# EAGLE design Teensy_Polulu_8848 (EAGLE 9.4.2)
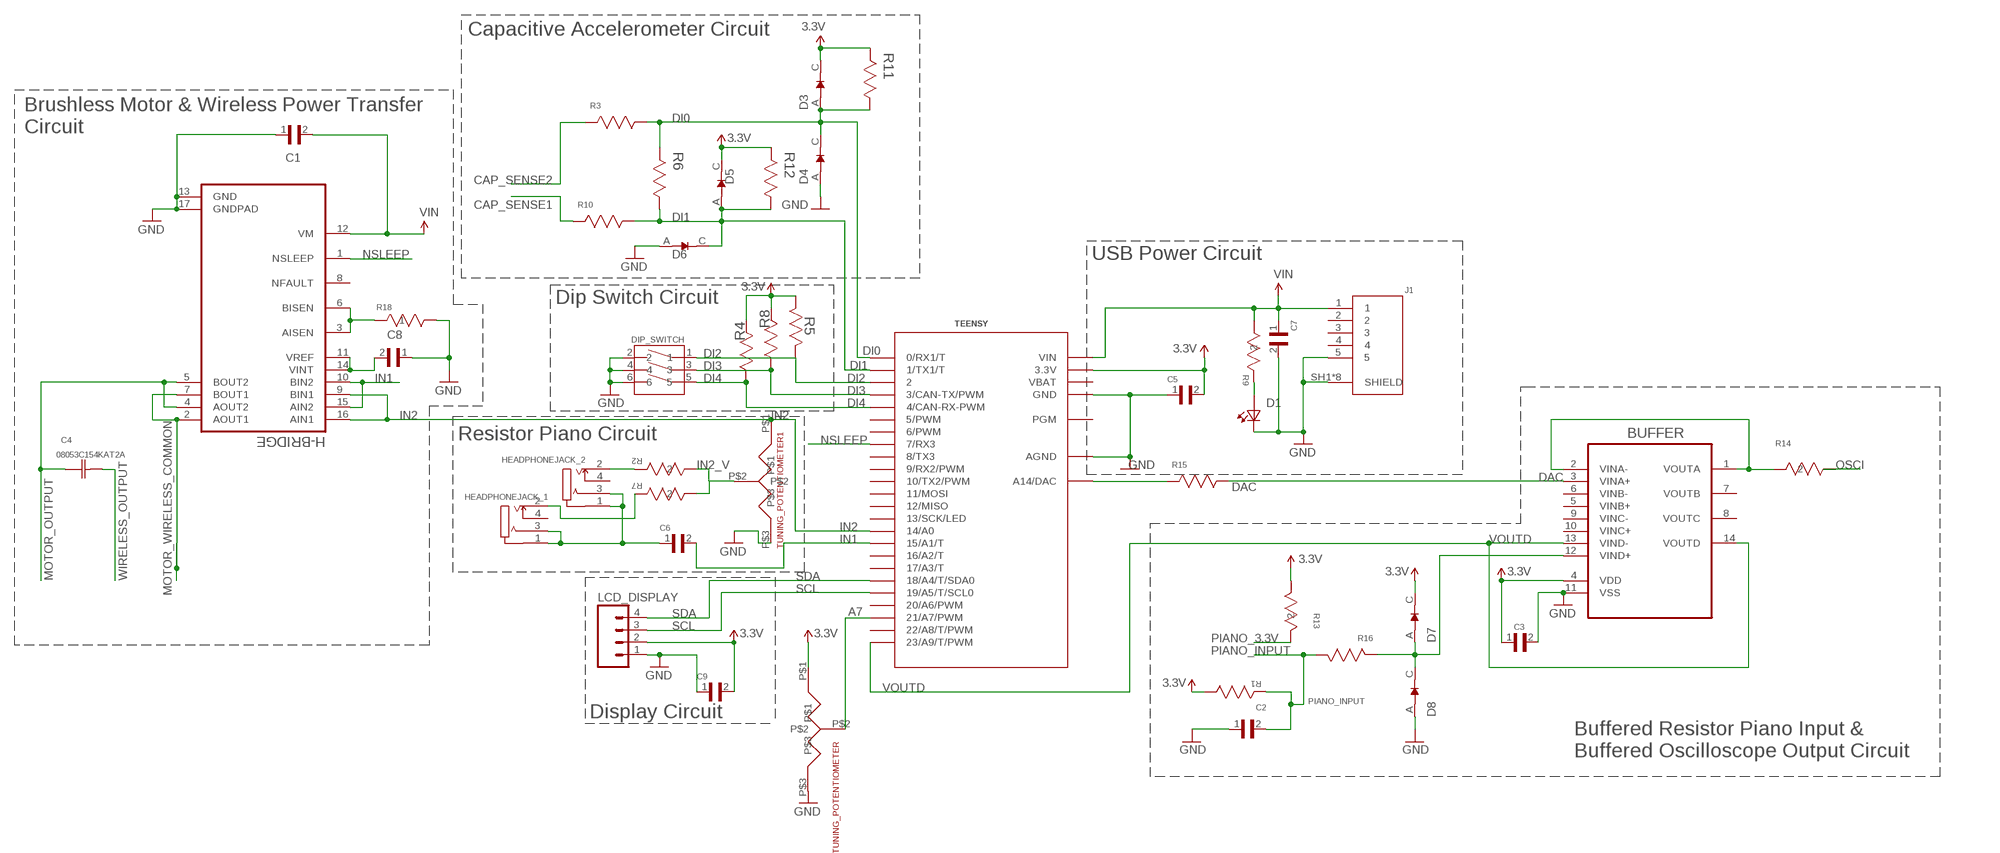
[diagram p0: schematic, sheet 1]

## Parts
BUFFER  MCP6024-I/SL  [SOIC127P600X175-14N]
C1  GRM219R60J476ME44D  [CAPC2012X135N]
C2  C2012C0G1V303J060AC  [INDC2012X87N]
C3  GRM219R60J476ME44D  [CAPC2012X135N]
C4  08053C154KAT2A  [CAPC2013X94N]
C5  GRM219R60J476ME44D  [CAPC2012X135N]
C6  GRM219R60J476ME44D  [CAPC2012X135N]
C7  GRM219R60J476ME44D  [CAPC2012X135N]
C8  GRM21BR60J225KA01L  [CAPC2012X135N]
C9  GRM219R60J476ME44D  [CAPC2012X135N]
D1  TLMY1100-GS08  [0603]
D3  1N4148W-7-F  [SOD3715X135N]
D4  1N4148W-7-F  [SOD3715X135N]
D5  1N4148W-7-F  [SOD3715X135N]
D6  1N4148W-7-F  [SOD3715X135N]
D7  1N4148W-7-F  [SOD3715X135N]
D8  1N4148W-7-F  [SOD3715X135N]
DIP_SWITCH  SDA03H1SBD  [SW_SDA03H1SBD]
H-BRIDGE  DRV8848PWP  [SOP65P640X120-17N]
HEADPHONEJACK_1  47257-0001  [MOLEX_47257-0001]
HEADPHONEJACK_2  47257-0001  [MOLEX_47257-0001]
J1  1050170001  [MOLEX_1050170001]
LCD_DISPLAY  M04POLAR  [MOLEX-1X4]
R1  RT0805FRE071ML  [RESC2013X65N]
R2  RT0805FRE07100RL  [RC0805N]
R3  RT0805FRE0710KL  [RESC2013X65N]
R4  RT0805FRE0710KL  [RESC2013X65N]
R5  RT0805FRE0710KL  [RESC2013X65N]
R6  RT0805FRE071ML  [RESC2013X65N]
R7  RT0805FRE07100RL  [RC0805N]
R8  RT0805FRE0710KL  [RESC2013X65N]
R9  RT0805FRE071KL  [RC0805N]
R10  RT0805FRE0710KL  [RESC2013X65N]
R11  RT0805FRE071ML  [RESC2013X65N]
R12  RT0805FRE071ML  [RESC2013X65N]
R13  RT0805BRD0749R9L  [RC0805N]
R14  RT0805FRE071KL  [RC0805N]
R15  RT0805FRE0710KL  [RESC2013X65N]
R16  RT0805FRE0710KL  [RESC2013X65N]
R18  CSRN2512FKR250  [STA_CSRN2512]
TEENSY  TEENSY_3.1-3.2_OUTER_ROW  [TEENSY_3.0-3.2&LC_OUTER_ROW]
TUNING_POTENTIOMETER  POT_PTV09A-4225F-B102-ND  [POT_PTV09A-4225F-B102-ND]
TUNING_POTENTIOMETER1  POT_PTV09A-4225F-B102-ND  [POT_PTV09A-4225F-B102-ND]

## Nets
3.3V: BUFFER.4(VDD) C3.1 C5.2 C9.2 D3.C(K) D5.C(K) D7.C(K) LCD_DISPLAY.2 R1.1(R1) R4.1(R1) R5.1(R1) R8.1(R1) R11.2(R2) R12.2(R2) R13.1 TEENSY.3.3V TEENSY.3.3V1(3.3V) TUNING_POTENTIOMETER.P$1
A7: TEENSY.21/A7(21/A7/PWM) TUNING_POTENTIOMETER.P$2
CAP_SENSE1: R10.2(R2)
CAP_SENSE2: R3.2(R2)
DAC: BUFFER.3(VINA+) R15.1(R1)
DI0: D3.A D4.C(K) R3.1(R1) R6.2(R2) R11.1(R1) TEENSY.0(0/RX1/T)
DI1: D5.A D6.C(K) R6.1(R1) R10.1(R1) R12.1(R1) TEENSY.1(1/TX1/T)
DI2: DIP_SWITCH.1 R5.2(R2) TEENSY.2
DI3: DIP_SWITCH.3 R8.2(R2) TEENSY.3(3/CAN-TX/PWM)
DI4: DIP_SWITCH.5 R4.2(R2) TEENSY.4(4/CAN-RX-PWM)
GND: BUFFER.11(VSS) C1.1 C2.1 C3.2 C5.1 C7.2 C8.1 C9.1 D1.1(K2) D4.A D6.A D8.A DIP_SWITCH.2 DIP_SWITCH.4 DIP_SWITCH.6 H-BRIDGE.13(GND) H-BRIDGE.17(GNDPAD) J1.5 J1.SH1(SHIELD) J1.SH2(SHIELD) J1.SH3(SHIELD) J1.SH4(SHIELD) J1.SH5(SHIELD) J1.SH6(SHIELD) J1.SH7(SHIELD) J1.SH8(SHIELD) LCD_DISPLAY.1 R18.2 TEENSY.AGND TEENSY.GND TEENSY.GND1(GND) TUNING_POTENTIOMETER1.P$3 TUNING_POTENTIOMETER.P$3
IN1: C6.2 H-BRIDGE.10(BIN2) H-BRIDGE.15(AIN2) TEENSY.15/A1(15/A1/T)
IN2: H-BRIDGE.9(BIN1) H-BRIDGE.16(AIN1) TEENSY.14/A0 TUNING_POTENTIOMETER1.P$1
IN2_V: R2.2 R7.2 TUNING_POTENTIOMETER1.P$2
MOTOR_OUTPUT: C4.1(C1) H-BRIDGE.4(AOUT2) H-BRIDGE.5(BOUT2)
MOTOR_WIRELESS_COMMON: H-BRIDGE.2(AOUT1) H-BRIDGE.7(BOUT1)
N$1: HEADPHONEJACK_2.2 R2.1
N$2: D1.2(A2) R9.1
N$3: HEADPHONEJACK_1.2 R7.1
N$10: H-BRIDGE.3(AISEN) H-BRIDGE.6(BISEN) R18.1
N$14: C8.2 H-BRIDGE.11(VREF) H-BRIDGE.14(VINT)
N$24: C6.1 HEADPHONEJACK_1.1 HEADPHONEJACK_1.3 HEADPHONEJACK_2.1 HEADPHONEJACK_2.3
N$27: BUFFER.1(VOUTA) BUFFER.2(VINA-) R14.2
N$28: BUFFER.12(VIND+) D7.A D8.C(K) R16.2(R2)
N$31: R15.2(R2) TEENSY.RESET/DAC(A14/DAC)
NSLEEP: H-BRIDGE.1(NSLEEP) TEENSY.7(7/RX3)
OSCI: R14.1
PIANO_3.3V: R13.2
PIANO_INPUT: C2.2 R1.2(R2) R16.1(R1)
SCL: LCD_DISPLAY.3 TEENSY.19/A5(19/A5/T/SCL0)
SDA: LCD_DISPLAY.4 TEENSY.18/A4(18/A4/T/SDA0)
VIN: C1.2 C7.1 H-BRIDGE.12(VM) J1.1 R9.2 TEENSY.VIN
VOUTD: BUFFER.13(VIND-) BUFFER.14(VOUTD) TEENSY.23/A9(23/A9/T/PWM)
WIRELESS_OUTPUT: C4.2(C2)
Unconnected: BUFFER.5(VINB+) BUFFER.6(VINB-) BUFFER.7(VOUTB) BUFFER.8(VOUTC) BUFFER.9(VINC-) BUFFER.10(VINC+) H-BRIDGE.8(NFAULT) HEADPHONEJACK_1.4 HEADPHONEJACK_2.4 J1.2 J1.3 J1.4 TEENSY.5(5/PWM) TEENSY.6(6/PWM) TEENSY.8(8/TX3) TEENSY.9(9/RX2/PWM) TEENSY.10(10/TX2/PWM) TEENSY.11(11/MOSI) TEENSY.12(12/MISO) TEENSY.13(13/SCK/LED) TEENSY.16/A2(16/A2/T) TEENSY.17/A3(17/A3/T) TEENSY.20/A6(20/A6/PWM) TEENSY.22/A8(22/A8/T/PWM) TEENSY.PGM

## Notes on the sheet
- Capacitive Accelerometer Circuit
- Brushless Motor & Wireless Power Transfer 
  Circuit
- USB Power Circuit
- Dip Switch Circuit
- Resistor Piano Circuit
- Display Circuit
- Buffered Resistor Piano Input & 
  Buffered Oscilloscope Output Circuit

## Power pins joined to a net without a drawn wire
VBAT: TEENSY.VBAT

## Library data of the parts
BUFFER = MCP6024-I_SL:MCP6024-I/SL: IC OPAMP 2.5V QUAD R-R; DESCRIPTION: MCP6024 Series 5.5 V 10 MHz Rail-to-Rail I/O Operational Amplifier SOIC-14; DIGI-KEY_PART_NUMBER: MCP6024-I/SL-ND; DIGI-KEY_PURCHASE_URL: https://www.digikey.com/product-detail/en/microchip-technology/MCP6024-I-SL/MCP6024-I-SL-ND/417835?utm_source=snapeda&utm_medium=aggregator&utm_campaign=symbol; MF: Microchip; MP: MCP6024-I/SL; PACKAGE: SOIC-14 Microchip
C1 C3 C5-C7 C9 = GRM219R60J476ME44D:GRM219R60J476ME44D: CAP CER 47UF 6.3V X5R 0805; DESCRIPTION: Cap Cer 47uf 6.3v X5r 0805; DIGI-KEY_PART_NUMBER: 490-13249-1-ND; DIGI-KEY_PURCHASE_URL: https://www.digikey.com/product-detail/en/murata-electronics-north-america/GRM219R60J476ME44D/490-13249-1-ND/5877457?utm_source=snapeda&utm_medium=aggregator&utm_campaign=symbol; MF: Murata; MP: GRM219R60J476ME44D; PACKAGE: 0805 Murata
C2 = C2012C0G1V303J060AC:C2012C0G1V303J060AC: GENERAL PURPOSE / 7" (180MM); AVAILABILITY: Unavailable; DESCRIPTION: Cap Ceramic 0.03uF 35V C0G 5% Pad SMD 0805 125C T/R; MF: TDK; MP: C2012C0G1V303J060AC; PACKAGE: 0805 TDK; PRICE: None
C4 = 08053C154KAT2A:08053C154KAT2A: Capacitor 0805; AVAILABILITY: Unavailable; DESCRIPTION: 0805 150nF Ceramic Multilayer Capacitor, 25 VDC, +125degC, X7R Dielec, +/-10%; MF: AVX; MP: 08053C154KAT2A; PACKAGE: 0805 AVX; PRICE: None
C8 = GRM21BR60J225KA01L:GRM21BR60J225KA01L: SMT X5R ceramic capacitor 2.2uF 6.3V; DESCRIPTION: Multilayer Ceramic Capacitor, GRM Series, 2.2 - F, - 10%, X5R, 6.3 V, 0805 [2012 Metric]; DIGI-KEY_PART_NUMBER: 490-1712-1-ND; DIGI-KEY_PURCHASE_URL: https://www.digikey.com/product-detail/en/murata-electronics-north-america/GRM21BR60J225KA01L/490-1712-1-ND/587428?utm_source=snapeda&utm_medium=aggregator&utm_campaign=symbol; MF: Murata; MP: GRM21BR60J225KA01L; PACKAGE: 0805 Murata
D1 = TLMY1100-GS08:TLMY1100-GS08: http://octopart.com/tlmy1100-gs08-vishay+semiconductor-9355178; AVAILABILITY: Unavailable; DESCRIPTION: Yellow 0603 160° 80 mcd 2.1 V 30 mA Non Diffused Surface Mount LED; MF: Vishay Semiconductor; MP: TLMY1100-GS08; PACKAGE: 0603 Vishay; PRICE: None
D3-D8 = 1N4148W-7-F:1N4148W-7-F: 1N4148W Series 2 A 100 V 400 mW Surface Mount Fast Switching Diode - SOD-123; AVAILABILITY: Unavailable; DESCRIPTION: 1N4148W Series 2 A 100 V 400 mW Surface Mount Fast Switching Diode - SOD-123; MF: Diodes Inc.; MP: 1N4148W-7-F; PACKAGE: SOD-123 Diodes Inc.; PRICE: None
DIP_SWITCH = SDA03H1SBD:SDA03H1SBD: Switch DIP OFF ON SPST 3 Raised Slide 0.1A 24VDC Gull Wing 1000Cycles 2.54mm SMD Tube; AVAILABILITY: Unavailable; DESCRIPTION: Switch DIP OFF ON SPST 3 Raised Slide 0.1A 24VDC Gull Wing 1000Cycles 2.54mm SMD Tube; MF: C&K; MP: SDA03H1SBD; PACKAGE: None; PRICE: None
H-BRIDGE = DRV8848PWP:DRV8848PWP: None; AVAILABILITY: Unavailable; DESCRIPTION: 2A Dual H-Bridge Motor Driver _PWM Control_ 16-HTSSOP -40 to 85; MF: Texas Instruments; MP: DRV8848PWP; PACKAGE: HTSSOP-16 Texas Instruments; PRICE: None
HEADPHONEJACK_1 HEADPHONEJACK_2 = 47257-0001:47257-0001: Conn Phone Jack F 4 POS Solder RA Thru-Hole 4 Terminal 1 Port Tube; AVAILABILITY: Unavailable; DESCRIPTION: Conn Phone Jack F 4 POS Solder RA Thru-Hole 4 Terminal 1 Port Tube; MF: Molex; MP: 47257-0001; PACKAGE: None; PRICE: None
J1 = 1050170001:1050170001: Conn.; Data; USB; Recept.; Micro; B Type; Bottom Mount, SMT, with Solder Tabs, Lead-Free; DESCRIPTION: Conn.; Data; USB; Recept.; Micro; B Type; Bottom Mount, SMT, with Solder Tabs, Lead-Free; DIGI-KEY_PART_NUMBER: WM1399CT-ND; DIGI-KEY_PURCHASE_URL: https://www.digikey.com/product-detail/en/molex/1050170001/WM1399CT-ND/2350885?utm_source=snapeda&utm_medium=aggregator&utm_campaign=symbol; MF: Molex; MP: 1050170001; PACKAGE: None
LCD_DISPLAY = SparkFun-Connectors:M04: Header 4 Standard 4-pin 0.1" header. Use with straight break away headers (SKU : PRT-00116), right angle break away headers (PRT-00553), swiss pins (PRT-00743), machine pins (PRT-00117), and female headers (PRT-00115). Molex polarized connector foot print use with SKU : PRT-08231 with associated crimp pins and housings. 1MM SMD Version SKU: PRT-10208
R1 R6 R11 R12 = RT0805FRE071ML:RT0805FRE071ML: RESISTOR, 0805; AVAILABILITY: Good; DESCRIPTION: Surface Mount Chip Resistor, Thin Film, RT Series, 1 Mohm, 125 mW, 1%, 150 V, 0805 [2012 Metric]; MF: Yageo; MP: RT0805FRE071ML; PACKAGE: 0805 Yageo; PRICE: 0.03 USD
R2 R7 = RT0805FRE07100RL:RT0805FRE07100RL; MANUFACTURER_PART_NUMBER: RT0805FRE07100RL; VENDOR: Yageo
R3 R10 R15 R16 = RT0805FRE0710KL:RT0805FRE0710KL: RESISTOR, 0805; AVAILABILITY: Good; DESCRIPTION: Surface Mount Chip Resistor, Thin Film, RT Series, 10 kohm, 125 mW, 1%, 150 V, 0805 [2012 Metric]; MF: Yageo; MP: RT0805FRE0710KL; PACKAGE: 0805 Yageo; PRICE: 0.03 USD; SPICEPREFIX: R
R4 R5 R8 = RT0805FRE0710KL:RT0805FRE0710KL: RESISTOR, 0805; AVAILABILITY: Good; DESCRIPTION: Surface Mount Chip Resistor, Thin Film, RT Series, 10 kohm, 125 mW, 1%, 150 V, 0805 [2012 Metric]; MF: Yageo; MP: RT0805FRE0710KL; PACKAGE: 0805 Yageo; PRICE: 0.03 USD
R9 R14 = RT0805FRE071KL:RT0805FRE071KL; MANUFACTURER_PART_NUMBER: RT0805FRE071KL; VENDOR: Yageo
R13 = RT0805BRD0749R9L:RT0805BRD0749R9L; MANUFACTURER_PART_NUMBER: RT0805BRD0749R9L; VENDOR: Yageo
R18 = CSRN2512FKR250:CSRN2512FKR250; MANUFACTURER_PART_NUMBER: CSRN2512FKR250; VENDOR: Stackpole International
TEENSY = Teensy_3_and_LC_Series_Boards_v1.4 4:TEENSY_3.1-3.2_OUTER_ROW: Footprint for Teensy 3.1 or 3.2 board using all pin connections on the outer perimeter
TUNING_POTENTIOMETER TUNING_POTENTIOMETER1 = POT_PTV09A-4225F-B102-ND:POT_PTV09A-4225F-B102-ND

## Board
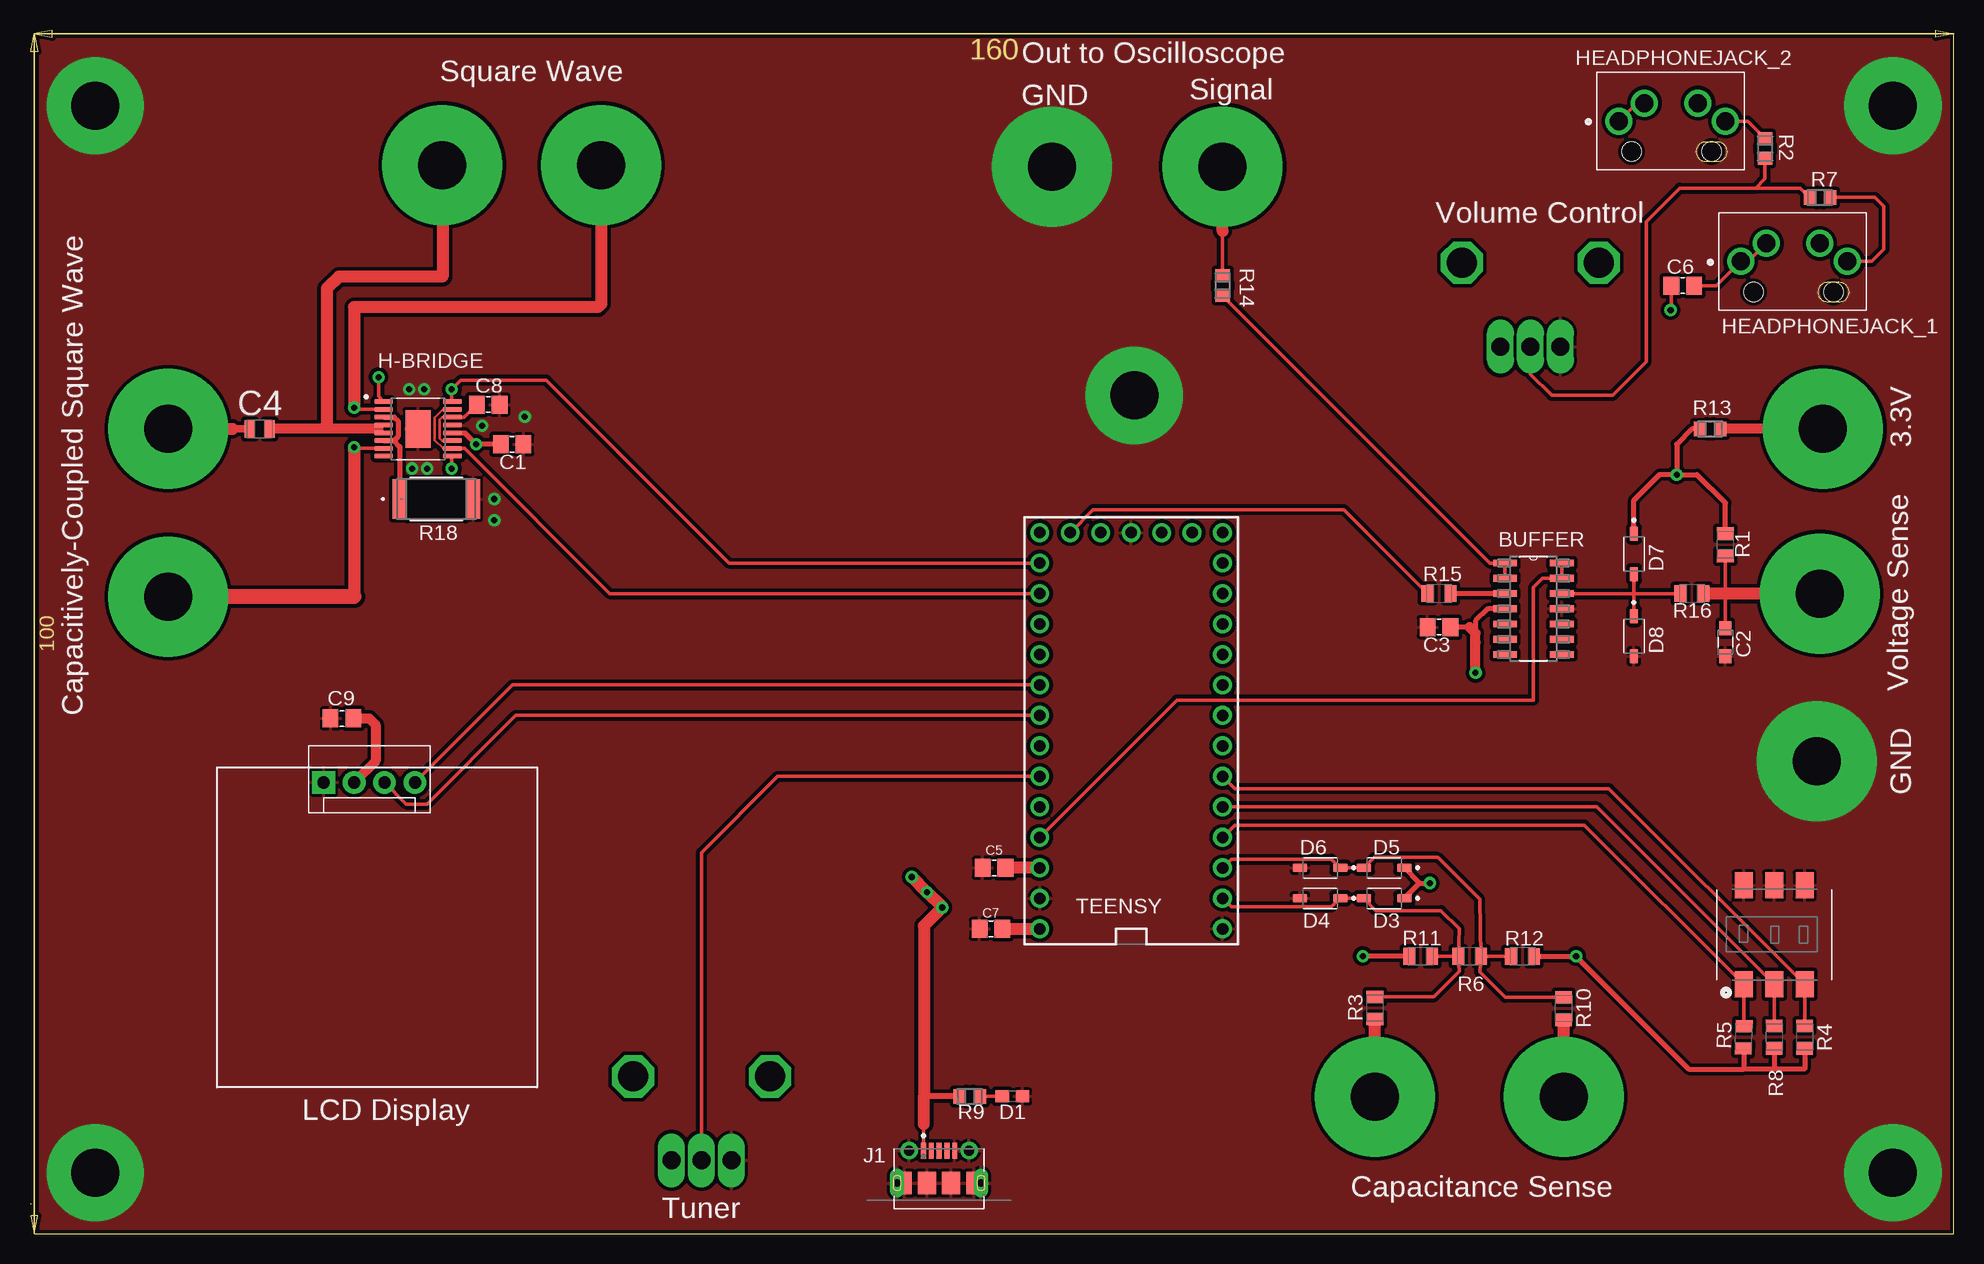
[diagram p1: board, top side]
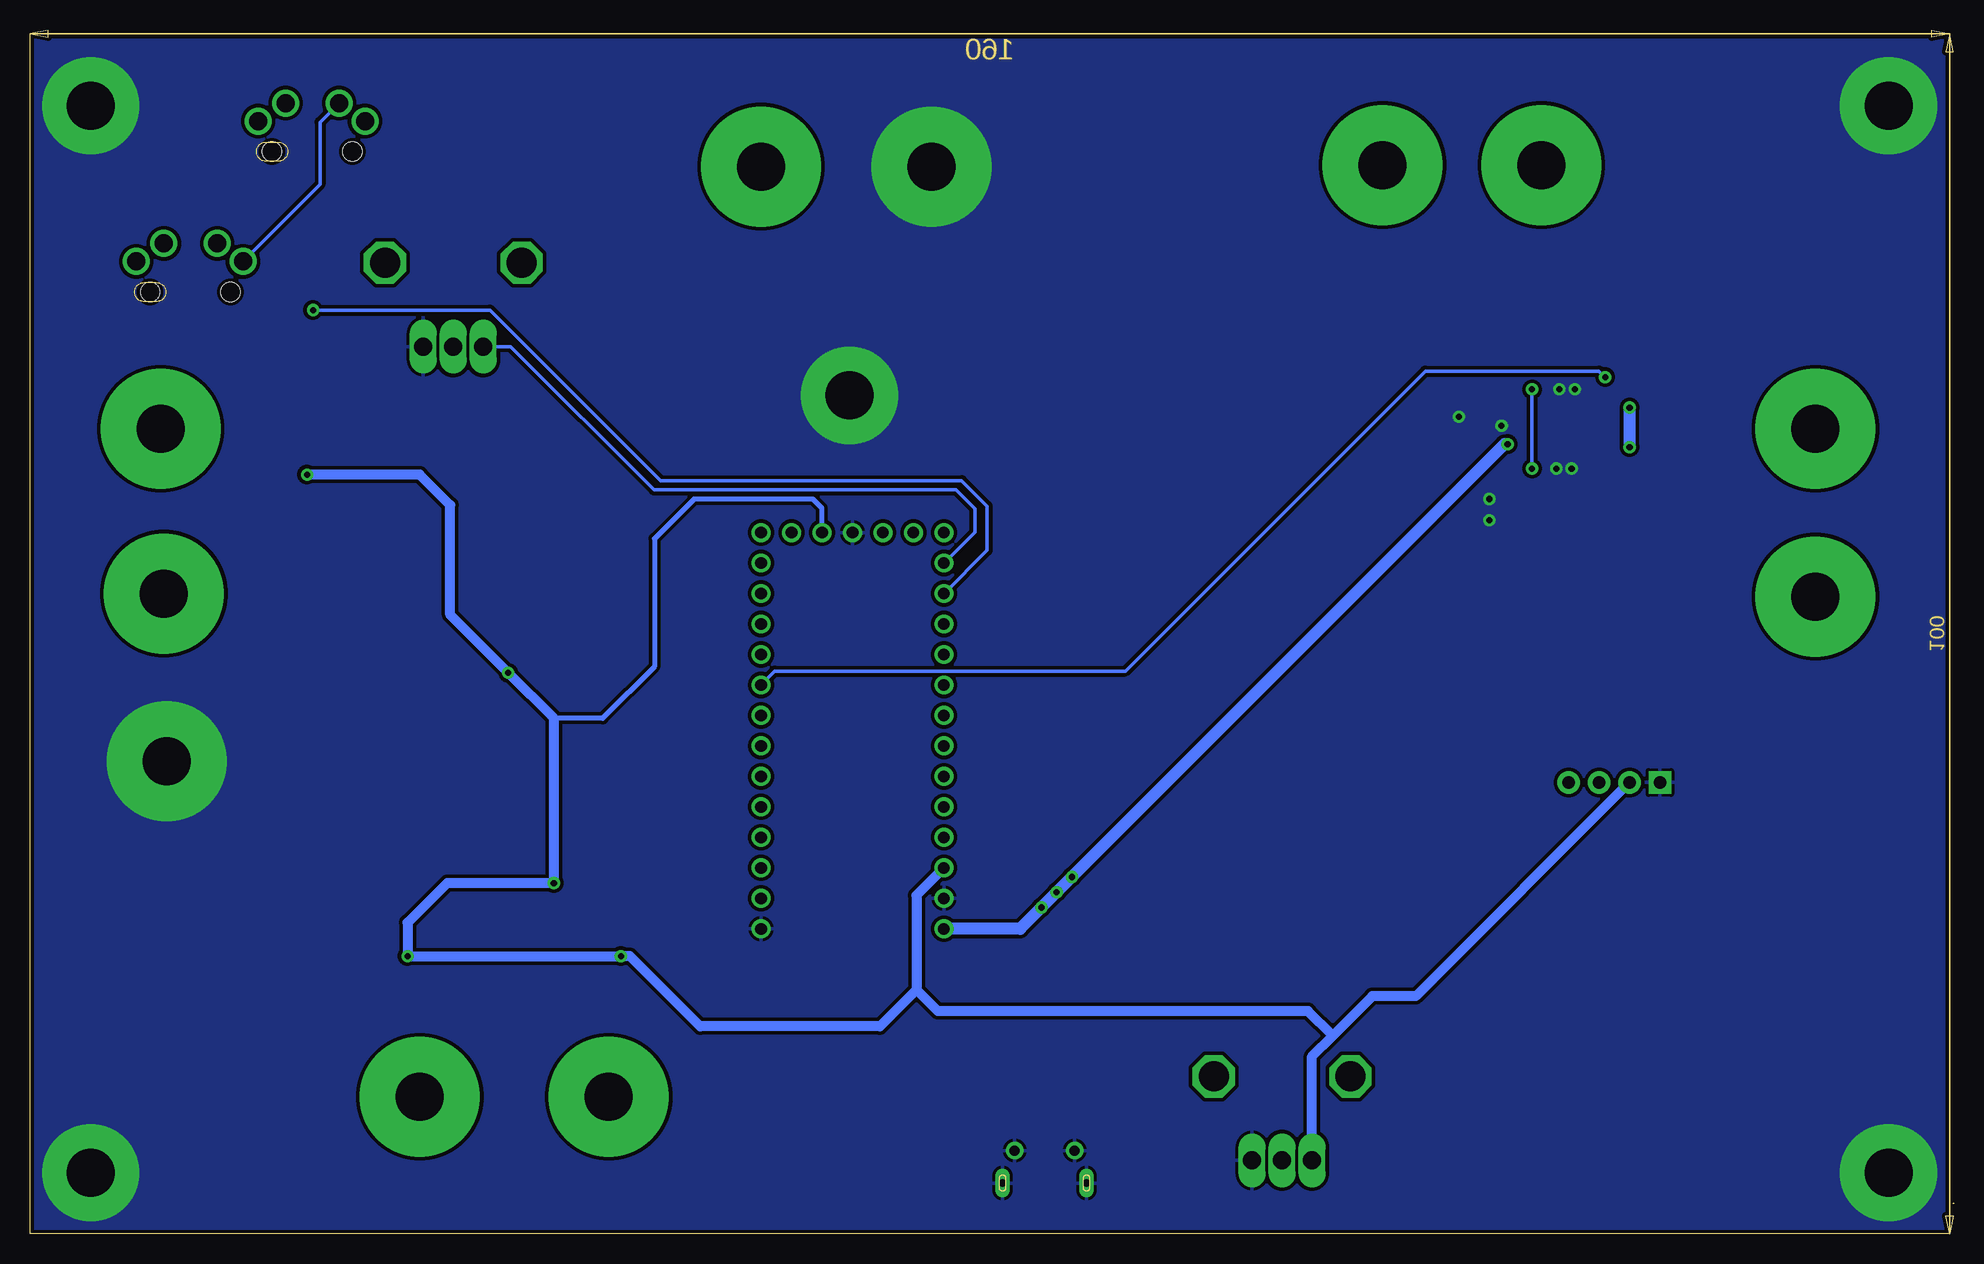
[diagram p2: board, bottom side, seen from below]

Size 160.35 x 100 mm. Coordinates in mm from the lower left corner, seen from the top.
Outline: 0,2.55 0.05,2.5 0.1,2.5
Outline: 0.35,0 160.35,0 160.35,100 0.35,100 0.35,0
Copper layers (1*16): Top 0.035mm / dielectric 1.5mm / Bottom 0.035mm
Design rules "SparkFun": minimum track width 8mil, minimum drill 20mil, track to track 8mil, track to pad 8mil, pad to pad 8mil, via to via 8mil, smd to smd 8mil, copper to edge 8mil, drill to drill 8mil, minimum pad ring 12mil, minimum via ring 10mil, stop-mask expansion 4mil, vias tented up to drill 20mil, thermal gap 10mil

### Footprints (pad centres in the part's own frame; a part is rotated, then mirrored left to right if it is on the bottom)
SOIC127P600X175-14N = smd 1.981 x 0.559: 1 -2.362,3.81; 2 -2.362,2.54; 3 -2.362,1.27; 4 -2.362,0; 5 -2.362,-1.27; 6 -2.362,-2.54; 7 -2.362,-3.81; 8 2.362,-3.81; 9 2.362,-2.54; 10 2.362,-1.27; 11 2.362,0; 12 2.362,1.27; 13 2.362,2.54; 14 2.362,3.81
CAPC2012X135N = smd 1.3 x 1.5: 1 -0.95,0; 2 0.95,0
INDC2012X87N = smd 1.15 x 1: 1 -1.175,0; 2 1.175,0
CAPC2013X94N = smd 0.914 x 1.448: 1 -0.813,0; 2 0.813,0
0603 = smd 1.1 x 1: 1 -0.85,0; 2 0.85,0
SOD3715X135N = smd 1.21 x 0.73: A 1.68,0; C -1.68,0
SW_SDA03H1SBD = smd 2.15 x 1.5: 1 -4.125,2.54; 2 4.125,2.54; 3 -4.125,0; 4 4.125,0; 5 -4.125,-2.54; 6 4.125,-2.54
SOP65P640X120-17N = smd 1.57 x 0.41: 1 -2.87,2.275; 2 -2.87,1.625; 3 -2.87,0.975; 4 -2.87,0.325; 5 -2.87,-0.325; 6 -2.87,-0.975; 7 -2.87,-1.625; 8 -2.87,-2.275; 9 2.87,-2.275; 10 2.87,-1.625; 11 2.87,-0.975; 12 2.87,-0.325; 13 2.87,0.325; 14 2.87,0.975; 15 2.87,1.625; 16 2.87,2.275 | smd 2.105 x 3.115: 17 0,0
MOLEX_47257-0001 = drill 1.5: 1 0,0; 2 8.9,0; 3 2.15,1.5; 4 6.6,1.5 | hole 1.6: 7.74,-2.55; 1.06,-2.55
MOLEX_1050170001 = smd 0.4 x 1.35: 1 -1.3,2.35; 2 -0.65,2.35; 3 0,2.35; 4 0.65,2.35; 5 1.3,2.35 | drill 0.85 pad 1.45: SH1 -2.5,2.35; SH2 2.5,2.35 | drill 0.6 pad 0.95 long: SH3 -3.5,-0.35; SH8 3.5,-0.35 | smd 1.2 x 1.9: SH4 -2.9,-0.35; SH7 2.9,-0.35 | smd 1.5 x 1.9: SH5 -1,-0.35; SH6 1,-0.35
MOLEX-1X4 = drill 1.016 pad 1.88 square: 1 0,0 | drill 1.016 pad 1.88: 2 2.54,0; 3 5.08,0; 4 7.62,0
RESC2013X65N = smd 1.016 x 1.397: 1 -0.94,0; 2 0.94,0
RC0805N = smd 1.016 x 1.219: 1 -0.851,0; 2 0.851,0
STA_CSRN2512 = smd 1.168 x 3.302: 1 -3.048,0; 2 3.048,0
TEENSY_3.0-3.2&LC_OUTER_ROW = drill 0.965: 0 -7.62,13.97; 1 -7.62,11.43; 2 -7.62,8.89; 3 -7.62,6.35; 3.3V 7.62,11.43; 3.3V1 -2.54,-16.51; 4 -7.62,3.81; 5 -7.62,1.27; 6 -7.62,-1.27; 7 -7.62,-3.81; 8 -7.62,-6.35; 9 -7.62,-8.89; 10 -7.62,-11.43; 11 -7.62,-13.97; 12 -7.62,-16.51; 13 7.62,-16.51; 14/A0 7.62,-13.97; 15/A1 7.62,-11.43; 16/A2 7.62,-8.89; 17/A3 7.62,-6.35; 18/A4 7.62,-3.81; 19/A5 7.62,-1.27; 20/A6 7.62,1.27; 21/A7 7.62,3.81; 22/A8 7.62,6.35; 23/A9 7.62,8.89; AGND 7.62,13.97; GND -7.62,16.51; GND1 0,-16.51; PGM 2.54,-16.51; RESET/DAC 5.08,-16.51; VBAT -5.08,-16.51; VIN 7.62,16.51
POT_PTV09A-4225F-B102-ND = drill 1.5 long: P$1 -2.5,0; P$2 0,0; P$3 2.5,0 | drill 2.5 octagon: P$4 -5.7,7; P$5 5.7,7

### Placement (x,y rotation side)
BUFFER  125.32,52.07 0 top
C1  40.19,65.77 180 top
C2  141.32,49.28 90 top
C3  117.44,50.55 180 top
C4  19.15,67.06 180 top
C5  80.36,30.48 0 top
C6  137.76,78.99 180 top
C7  80.11,25.4 180 top
C8  38.2,69.09 180 top
C9  26,42.93 0 top
D1  81.88,11.43 180 top
D3  112.87,27.94 180 top
D4  107.54,27.94 180 top
D5  112.87,30.48 180 top
D6  107.54,30.48 180 top
D7  133.7,56.64 270 top
D8  133.7,49.78 270 top
DIP_SWITCH  145.38,24.89 90 top
H-BRIDGE  32.35,67.06 0 top
HEADPHONEJACK_1  142.59,81.01 0 top
HEADPHONEJACK_2  132.43,92.71 0 top
J1  75.78,4.56 0 top
LCD_DISPLAY  24.48,37.59 0 top
R1  141.32,57.4 270 top
R2  144.62,90.42 270 top
R3  112.11,18.8 270 top
R4  147.92,16.37 90 top
R5  142.84,16.37 88.2 top
R6  120,23.11 180 top
R7  149.19,86.34 180 top
R8  145.38,16.37 90 top
R9  78.33,11.43 180 top
R10  127.83,18.75 270 top
R11  115.92,23.11 180 top
R12  124.4,23.1 0 top
R13  140.05,67.06 0 top
R14  99.41,78.99 270 top
R15  117.44,53.34 180 top
R16  138.53,53.34 180 top
R18  33.88,61.21 0 top
TEENSY  91.79,41.91 180 top
TUNING_POTENTIOMETER  55.98,6.1 0 top
TUNING_POTENTIOMETER1  125.06,73.91 0 top

### Tracks (layer width: path | path; a pad name or v marks a point on that pad's centre or on a via)
3.3V  (via drill 0.51)
  Top 0.406: BUFFER.4 121.51,52.07 120.49,51.05 120.49,49.28 | 119.98,50.55 C3.1 | R13.1 138.53,67.06 137.26,65.79 v137.26,63.25 | R12.2 v128.86,23.1 v128.87,23.11 138.27,13.72 142.84,13.72 | v137.26,63.25 135.83,63.25 133.7,61.12 D7.C | v137.26,63.25 138.96,63.25 141.32,60.88 R1.1 | 145.38,13.72 142.84,13.72 | R5.1 142.84,15.4 142.84,13.72 | R8.1 145.38,13.72 | R4.1 147.92,13.72 145.38,13.72 | D3.C 115.82,29.21 | D5.C 115.82,29.21 | 115.82,29.21 v116.68,29.21 | R11.2 v111.09,23.11
  Top 0.813: C9.2 28.29,42.93 28.8,42.42 28.8,39.37 LCD_DISPLAY.2 | v120.49,46.74 120.49,49.28 120.49,50.04 119.98,50.55
  Top 1.016: TEENSY.3.3V C5.2
  Bottom 0.406: TEENSY.3.3V1 94.33,60.45 95.09,61.21 105,61.21 108.3,57.91 108.3,47.24 112.62,42.93 116.68,42.93
  Bottom 0.813: LCD_DISPLAY.2 44.83,19.78 48.46,19.78 51.77,16.48 | TUNING_POTENTIOMETER.P$1 53.48,14.77 51.77,16.48 | 86.46,20.32 84.68,18.54 53.83,18.54 51.77,16.48 | TEENSY.3.3V 86.46,28.19 86.46,20.32 | 86.46,20.32 89.5,17.27 104.49,17.27 110.33,23.11 v111.09,23.11 v128.87,23.11 128.87,25.91 125.57,29.21 v116.68,29.21 116.68,42.93 v120.49,46.74 125.32,51.56 125.32,60.71 127.86,63.25 v137.26,63.25
A7
  Top 0.305: TEENSY.21/A7 62.33,38.1 55.98,31.75 TUNING_POTENTIOMETER.P$2
CAP_SENSE1  (via drill 4 pad 10)
  Top 1.016: R10.2 127.83,11.42 v127.86,11.4
CAP_SENSE2  (via drill 4 pad 10)
  Top 1.016: v112.11,11.4 R3.2
DAC
  Top 0.406: BUFFER.3 R15.1
DI0
  Top 0.305: TEENSY.0 100.13,27.22 108.5,27.22 D4.C D3.A 112.21,26.92 117.61,26.92 119.15,25.39 R6.2 | R3.1 117.01,19.74 119.15,21.87 R6.2 | R11.1 R6.2
DI1
  Top 0.305: TEENSY.1 100.13,31.2 108.5,31.2 D6.C D5.A 112.06,31.34 117.34,31.34 120.83,27.85 120.85,27.84 R6.1 | R10.1 122.97,19.68 120.83,21.82 120.85,21.83 R6.1 | R12.1 120.86,23.1 R6.1
DI2
  Top 0.305: TEENSY.2 100.43,34.04 129.57,34.04 DIP_SWITCH.1 142.84,17.34 R5.2
  Top 0.406: R5.2 142.84,17.34 R5.2 | R5.2
DI3
  Top 0.305: TEENSY.3 130.59,35.56 DIP_SWITCH.3 R8.2
DI4
  Top 0.305: TEENSY.4 100.43,37.08 131.61,37.08 DIP_SWITCH.5 R4.2
GND  (via drill 0.51, 4 pad 10, 4 pad 8.1)
  other vias: 155.29,5.08 5.43,5.08 5.43,93.98 155.29,93.98 148.94,39.37 85.19,88.92 92.04,69.85 31.59,70.36 32.86,70.36 31.85,63.75 33.12,63.75 41.24,68.07 37.69,67.31 38.7,61.21 38.7,59.44
  pour Top (isolate 0.305): 0.3,0 160.12,0 160.32,0.2 160.32,99.97 0.91,100.48 0.3,99.87
  pour Bottom (isolate 0.305): 0.35,0 0.35,100.03 160.37,100.03 160.37,0 160.37,0 0.35,0
IN1  (via drill 0.51)
  Top 0.203: H-BRIDGE.10 34.42,65.43 33.73,66.13 33.73,67.99 34.42,68.68 H-BRIDGE.15
  Top 0.305: H-BRIDGE.10 36.24,65.43 48.33,53.34 TEENSY.15/A1 | C6.2 136.81,77.03 v136.75,76.96
  Bottom 0.305: v136.75,76.96 122.01,76.96 107.79,62.74 82.69,62.74 80.57,60.62 80.57,56.94 TEENSY.15/A1
IN2  (via drill 0.51)
  Top 0.305: TEENSY.14/A0 58.26,55.88 43.02,71.12 35.91,71.12 v35.15,70.36 35.15,69.41 H-BRIDGE.16 | H-BRIDGE.9 35.15,64.7 v35.15,63.75
  Bottom 0.305: TUNING_POTENTIOMETER1.P$1 120.28,73.91 108.34,61.98 83.15,61.98 81.58,60.41 81.58,58.47 TEENSY.14/A0 | v35.15,70.36 v35.15,63.75
IN2_V
  Top 0.305: TUNING_POTENTIOMETER1.P$2 125.06,71.63 126.84,69.85 131.92,69.85 134.72,72.64 134.72,84.33 137.51,87.12 143.86,87.12 | R2.2 144.62,87.88 143.86,87.12 | R7.2 147.56,87.12 143.86,87.12
MOTOR_OUTPUT  (via drill 4 pad 10)
  Top 0.254: H-BRIDGE.5 29.38,66.73 29.05,67.06
  Top 0.305: H-BRIDGE.5 29.31,66.91 29.31,67.31 29.41,67.31 H-BRIDGE.4
  Top 0.406: 24.73,67.31 24.99,67.06 28.8,67.06
  Top 0.813: 29.05,67.06 28.8,67.06 C4.1
  Top 1.016: v34.37,89.04 34.39,89.03 34.39,79.76 25.75,79.76 24.73,78.74 24.73,67.31
MOTOR_WIRELESS_COMMON  (via drill 0.51, 4 pad 10)
  Top 0.305: H-BRIDGE.7 27.17,65.43 27.02,65.28 | H-BRIDGE.2 27.17,68.68 v27.02,68.83
  Top 1.016: v47.61,89.04 47.61,77.49 47.34,77.22 27.02,77.22 v27.02,68.83 | v27.02,65.53 27.02,65.28 27.02,53.09
  Top 1.27: 27.02,53.09 v11.53,53.09
  Bottom 1.016: v27.02,68.83 v27.02,65.53
N$1
  Top 0.305: HEADPHONEJACK_2.2 143.19,92.71 R2.1
N$2
  Top 0.305: R9.1 D1.2
N$3
  Top 0.305: HEADPHONEJACK_1.2 153.52,81.01 154.53,82.02 154.53,85.6 153.78,86.34 R7.1
N$10
  Top 0.406: 30.34,66.08 30.83,65.59 R18.1 | 30.32,66.06 | 30.68,66.42 30.32,66.06 | H-BRIDGE.3 30.36,68.03 30.68,67.72 30.68,66.42 | H-BRIDGE.6 30.34,66.08 | 30.34,66.08 30.32,66.06 | 30.68,66.42 | 30.68,66.42 30.34,66.08
N$14
  Top 0.203: H-BRIDGE.14 34.34,68.03 34.13,67.82 34.13,66.29 34.34,66.08 H-BRIDGE.11
  Top 0.305: C8.2 36.19,68.03 H-BRIDGE.14
N$24
  Top 0.305: C6.1 140.57,78.99 HEADPHONEJACK_1.1 143.24,81.01 HEADPHONEJACK_1.3 | HEADPHONEJACK_2.1 133.93,94.21 HEADPHONEJACK_2.3
  Bottom 0.305: HEADPHONEJACK_2.3 136.17,92.62 136.17,87.43 HEADPHONEJACK_1.1
N$27
  Top 0.305: R14.2 121.67,55.88 BUFFER.1 BUFFER.2
N$28
  Top 0.305: R16.2 133.7,53.34 | D8.C D7.A 133.7,53.34 | BUFFER.12 133.7,53.34
N$31
  Top 0.305: R15.2 109.52,60.33 88.61,60.33 TEENSY.RESET/DAC
NSLEEP  (via drill 0.51)
  Top 0.305: v29.05,71.37 29.05,69.76 H-BRIDGE.1
  Bottom 0.305: TEENSY.7 98.27,46.86 69.06,46.86 44.04,71.88 29.56,71.88 v29.05,71.37
OSCI  (via drill 4 pad 10)
  Top 0.305: R14.1 99.41,83.57
  Top 1.016: 99.41,83.57 v99.41,88.92
PIANO_3.3V  (via drill 4 pad 10)
  Top 0.813: R13.2 140.82,67.06 140.82,67.07 140.83,67.07 v149.45,67.07
PIANO_INPUT  (via drill 4 pad 10)
  Top 0.305: R1.2 141.32,53.34 | 141.32,53.34 R16.1 139.8,53.34 | C2.2 141.32,53.34
  Top 1.016: v149.19,53.34 139.8,53.34
SCL
  Top 0.305: TEENSY.19/A5 40.48,43.18 33.09,35.79 31.36,35.79 LCD_DISPLAY.3
SDA
  Top 0.305: TEENSY.18/A4 40.23,45.72 LCD_DISPLAY.4
VIN  (via drill 0.51)
  Top 0.305: 74.48,9.11 J1.1
  Top 0.406: H-BRIDGE.12 36.23,66.73 v37.18,65.79 37.19,65.77 C1.2
  Top 0.508: 74.48,9.11 74.52,9.14 | R9.2 74.52,11.43
  Top 1.016: C7.1 TEENSY.VIN | 74.52,9.14 74.52,11.43 74.52,25.65 v76.04,27.18 v74.77,28.45 v73.5,29.72
  Bottom 1.016: TEENSY.VIN 77.82,25.4 v76.04,27.18 v73.5,29.72 37.43,65.79 v37.18,65.79
VOUTD
  Top 0.305: TEENSY.23/A9 95.6,44.45 125.32,44.45 125.32,53.85 126.08,54.61 BUFFER.13 BUFFER.14
WIRELESS_OUTPUT  (via drill 4 pad 10)
  Top 0.305: C4.2 18.38,67.06
  Top 0.61: 16.86,67.06 18.38,67.06
  Top 1.016: v11.53,67.07 11.54,67.06 16.86,67.06

### Text on the board
tNames: Out to Oscilloscope | Square Wave | GND | Signal | Volume Control | 3.3V | Voltage Sense | Capacitively-Coupled Square Wave | GND | LCD Display | Capacitance Sense | Tuner